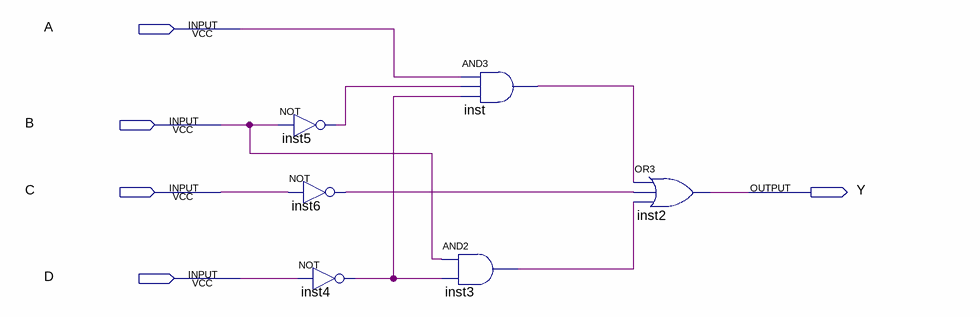
[diagram p0: schematic sheet]
// Quartus schematic lecture04_26.bdf as structural Verilog: 6 symbols, 5 pins
module lecture04_26 (
  input  A,
  input  B,
  input  C,
  input  D,
  output Y
);

  wire inst3_out, inst4_out, inst5_out, inst6_out, inst_out;

  not inst5 (inst5_out, B);
  not inst6 (inst6_out, C);
  not inst4 (inst4_out, D);
  and inst (inst_out, A, inst5_out, inst4_out);
  and inst3 (inst3_out, B, inst4_out);
  or inst2 (Y, inst_out, inst6_out, inst3_out);
endmodule
